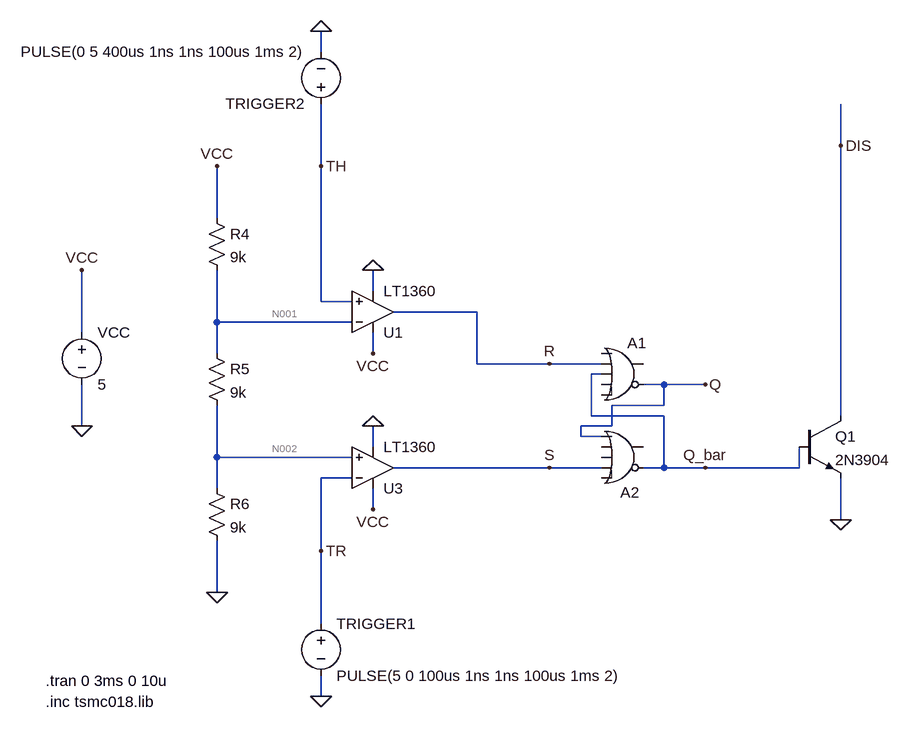
[diagram p0: schematic q1_bistable.asc]
* q1_bistable.asc
R4 VCC N001 9k
R5 N001 N002 9k
R6 N002 0 9k
VCC VCC 0 5
A1 0 R Q_bar 0 0 Q 0 0 OR Vhigh=5 Vlow=0 Ref=1.0
A2 Q 0 0 S 0 Q_bar 0 0 OR Vhigh=5 Vlow=0 Ref=1.0
V§TRIGGER1 TR 0 PULSE(5 0 100us 1ns 1ns 100us 1ms 2)
* U1: LT1360 (symbol OpAmps\LT1360 not available, pins judged from their places): In+=TH In-=N001 V+=VCC V-=0 OUT=R
* U3: LT1360 (symbol OpAmps\LT1360 not available, pins judged from their places): In+=N002 In-=TR V+=VCC V-=0 OUT=S
Q1 DIS Q_bar 0 0 2N3904
V§TRIGGER2 TH 0 PULSE(0 5 400us 1ns 1ns 100us 1ms 2)
.model NPN NPN
.model PNP PNP
.lib standard.bjt
.inc tsmc018.lib
.tran 0 3ms 0 10u
.backanno
.end

* Results of the author's LTspice run, read from the files saved beside the schematic
* Operating Point, zero values left out:
*   V(n001) = 3.331 V
*   V(r) = 726.9 mV
*   V(s) = 723.5 mV
*   V(vcc) = 5 V
*   V(n002) = 1.668 V
*   V(q) = 5 V
*   V(tr) = 5 V
*   I(R4) = 185.5 µA
*   I(R6) = 185.3 µA
*   I(R5) = 184.7 µA
*   I(VCC) = -5.675 mA
*   I(TRIGGER1) = -797 nA
*   I(TRIGGER2) = 716.1 nA
*   Ix(u3:1) = -602.4 nA
*   Ix(u3:2) = 797 nA
*   Ix(u3:3) = 2.745 mA
*   Ix(u3:4) = -2.745 mA
*   Ix(u3:5) = 3.553 pA
*   Ix(u1:1) = -716.1 nA
*   Ix(u1:2) = 763.3 nA
*   Ix(u1:3) = 2.745 mA
*   Ix(u1:4) = -2.745 mA
*   Ix(u1:5) = 3.546 pA
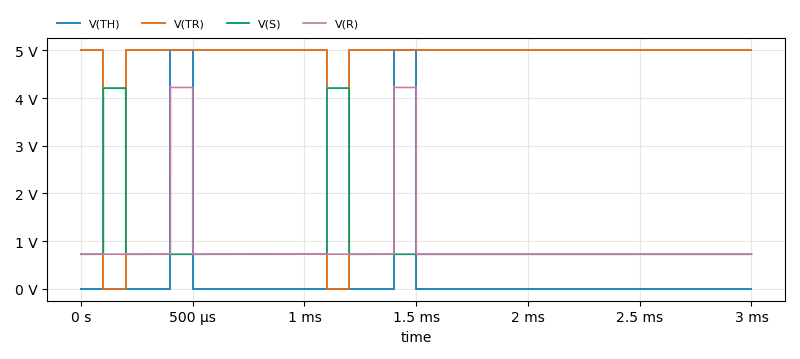
[diagram p1: Transient Analysis of q1_bistable.asc, plotted from the saved traces]
* Transient Analysis, 1 run:
*   V(TH): min 0 V, max 5 V, average 333.3 mV, rms 1.291 V, last 0 V
*   V(TR): min 0 V, max 5 V, average 4.667 V, rms 4.83 V, last 5 V
*   V(S): min 722.4 mV, max 4.211 V, average 955.4 mV, rms 1.291 V, last 723.5 mV
*   V(R): min 723.2 mV, max 4.249 V, average 959.8 mV, rms 1.297 V, last 726.9 mV